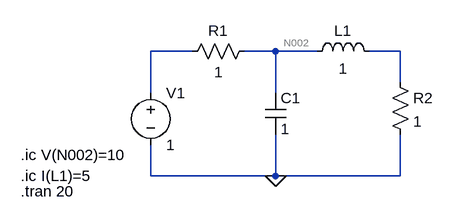
[diagram p0: schematic ejercicio2.asc]
ejercicio2.asc, the LTspice schematic file:
Version 4
SHEET 1 880 680
WIRE 112 96 48 96
WIRE 240 96 192 96
WIRE 304 96 240 96
WIRE 432 96 384 96
WIRE 432 144 432 96
WIRE 48 160 48 96
WIRE 240 160 240 96
WIRE 48 288 48 240
WIRE 240 288 240 224
WIRE 240 288 48 288
WIRE 432 288 432 224
WIRE 432 288 240 288
FLAG 240 288 0
SYMBOL voltage 48 144 R0
SYMATTR InstName V1
SYMATTR Value 1
SYMBOL res 208 80 R90
WINDOW 0 0 56 VBottom 2
WINDOW 3 32 56 VTop 2
SYMATTR InstName R1
SYMATTR Value 1
SYMBOL cap 224 160 R0
SYMATTR InstName C1
SYMATTR Value 1
SYMBOL ind 288 112 R270
WINDOW 0 32 56 VTop 2
WINDOW 3 5 56 VBottom 2
SYMATTR InstName L1
SYMATTR Value 1
SYMBOL res 416 128 R0
SYMATTR InstName R2
SYMATTR Value 1
TEXT -152 256 Left 2 !.ic V(N002)=10
TEXT -152 288 Left 2 !.ic I(L1)=5
TEXT -152 312 Left 2 !.tran 20

The netlist it stands for:
* ejercicio2.asc
V1 N001 0 1
R1 N002 N001 1
C1 N002 0 1
L1 N002 N003 1
R2 N003 0 1
.ic V(N002)=10
.ic I(L1)=5
.tran 20
.backanno
.end